# EAGLE design STl-Link-V01 (EAGLE 6.3)
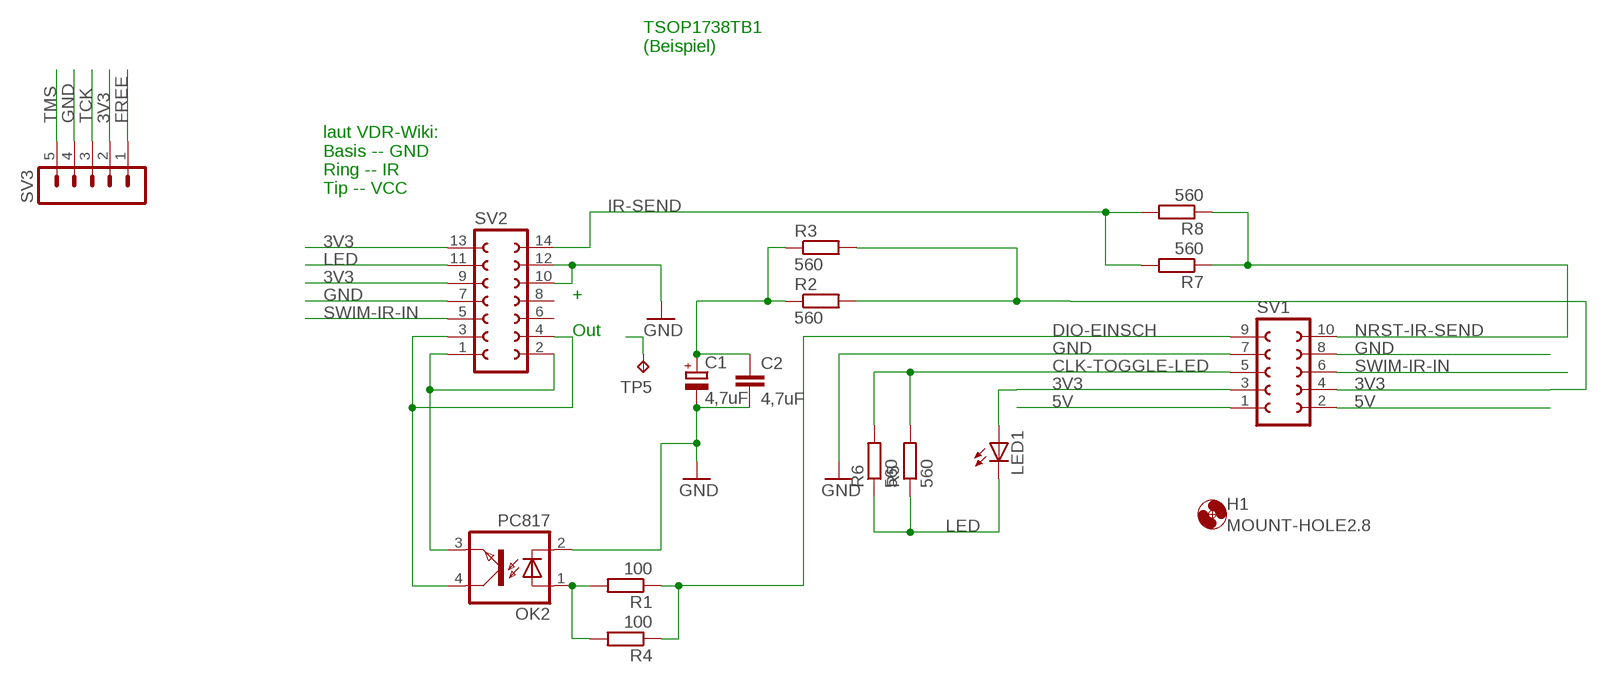
[diagram p0: schematic, sheet 1]

## Parts
C1  4,7uF  CPOL-EUE1.8-4  [E1,8-4]
C2  4,7uF  C-EUC1206K  [C1206K]
H1  MOUNT-HOLE2.8  [2,8]
LED1  LEDCHIPLED_1206  [CHIPLED_1206]
OK2  PC817  [DIL04]
R1  100  R-EU_0204/7  [0204/7]
R2  560  R-EU_0204/7  [0204/7]
R3  560  R-EU_R0805W  [R0805W]
R4  100  R-EU_R0805W  [R0805W]
R5  560  R-EU_0204/7  [0204/7]
R6  560  R-EU_R0805W  [R0805W]
R7  560  R-EU_0204/7  [0204/7]
R8  560  R-EU_R0805W  [R0805W]
SV1  FE05-2  [FE05-2]
SV2  FE07-2W  [FE07-2W]
SV3  MAR05-1  [MAR05-1]
TP5  TPB1,27  [B1,27]

## Nets
3V3: LED1.A R2.2 R3.2 SV1.3 SV1.4 SV2.9 SV2.13 SV3.2
5V: SV1.1 SV1.2
CLK-TOGGLE-LED: R5.2 R6.2 SV1.5
DIO-EINSCH: R1.1 R4.1 SV1.9
FREE: SV3.1
GND: C1.- C2.2 OK2.2(C) SV1.7 SV1.8 SV2.7 SV2.10 SV2.12 SV3.4
IR-SEND: R7.2 R8.2 SV2.14
LED: LED1.C R5.1 R6.1 SV2.11
N$1: C1.+ C2.1 R2.1 R3.1
N$2: OK2.1(A) R1.2 R4.2
N$4: OK2.3(EMIT) SV2.1 SV2.2
NRST-IR-SEND: R7.1 R8.1 SV1.10
OK2: OK2.4(COL) SV2.3 SV2.4
SWIM-IR-IN: SV1.6 SV2.5 TP5.TP
TCK: SV3.3
TMS: SV3.5
Unconnected: SV2.6 SV2.8

## Notes on the sheet
- TSOP1738TB1
  (Beispiel)
- laut VDR-Wiki:
  Basis -- GND
  Ring -- IR
  Tip -- VCC
- +
- Out

## Library data of the parts
C1 = rcl:CPOL-EU: POLARIZED CAPACITOR, European symbol
C2 = rcl:C-EU: CAPACITOR, European symbol
H1 = holes:MOUNT-HOLE: MOUNTING HOLE with drill center marker
LED1 = led:LED: LED OSRAM: - CHIPLED LG R971, LG N971, LY N971, LG Q971, LY Q971, LO R971, LY R971 LH N974, LH R974 LS Q976, LO Q976, LY Q976 LO Q996 - Hyper CHIPLED LW Q18S LB Q993, LB Q99A, LB R99A - SideLED LS A670, LO A670, LY A670, LG A670, LP A670 LB A673, LV A673, LT A673, LW A673 LH A674 LY A675 LS A676, LA A676, LO A676, LY A676, LW A676 LS A679, LY A679, LG A679 - Hyper Micro SIDELED® LS Y876, LA Y876, LO Y876, LY Y876 LT Y87S - SmartLED LW L88C, LW L88S LB L89C, LB L89S, LG L890 LS L89K, LO L89K, LY L89K LS L896, LA L896, LO L896, LY L896 - TOPLED LS T670, LO T670, LY T670, LG T670, LP T670 LSG T670, LSP T670, LSY T670, LOP T670, LYG T670 LG T671, LOG T671, LSG T671 LB T673, LV T673, LT T673, LW T673 LH T674 LS T676, LA T676, LO T676, LY T676, LB T676, LH T676, LSB T676, LW T676 LB T67C, LV T67C, LT T67C, LS T67K, LO T67K, LY T67K, LW E67C LS E67B, LA E67B, LO E67B, LY E67B, LB E67C, LV E67C, LT E67C LW T67C LS T679, LY T679, LG T679 LS T770, LO T770, LY T770, LG T770, LP T770 LB T773, LV T773, LT T773, LW T773 LH T774 LS E675, LA E675, LY E675, LS T675 LS T776, LA T776, LO T776, LY T776, LB T776 LHGB T686 LT T68C, LB T68C - Hyper Mini TOPLED® LB M676 - Mini TOPLED Santana® LG M470 LS M47K, LO M47K, LY M47K Source: http://www.osram.convergy.de LUXEON: - LUMILED® LXK2-PW12-R00, LXK2-PW12-S00, LXK2-PW14-U00, LXK2-PW14-V00 LXK2-PM12-R00, LXK2-PM12-S00, LXK2-PM14-U00 LXK2-PE12-Q00, LXK2-PE12-R00, LXK2-PE12-S00, LXK2-PE14-T00, LXK2-PE14-U00 LXK2-PB12-K00, LXK2-PB12-L00, LXK2-PB12-M00, LXK2-PB14-N00, LXK2-PB14-P00, LXK2-PB14-Q00 LXK2-PR12-L00, LXK2-PR12-M00, LXK2-PR14-Q00, LXK2-PR14-R00 LXK2-PD12-Q00, LXK2-PD12-R00, LXK2-PD12-S00 LXK2-PH12-R00, LXK2-PH12-S00 LXK2-PL12-P00, LXK2-PL12-Q00, LXK2-PL12-R00 Source: www.luxeon.com KINGBRIGHT: KA-3528ASYC Source: www.kingbright.com
OK2 = optocoupler:PC817: SHARP OPTO COUPLER; MPN: PC817X4J000F; OC_FARNELL: 9707727; OC_NEWARK: 97K7059
R1-R8 = rcl:R-EU_: RESISTOR, European symbol
SV1 = con-lsta:FE05-2: FEMALE HEADER; OC_FARNELL: unknown; OC_NEWARK: unknown
SV2 = con-lsta:FE07-2W: FEMALE HEADER; OC_FARNELL: unknown; OC_NEWARK: unknown
SV3 = con-lstb:MAR05-1: PIN HEADER; OC_FARNELL: unknown; OC_NEWARK: unknown
TP5 = testpad:TP: Test pad

## Net classes
0 default: width 0.406 mm

## Board
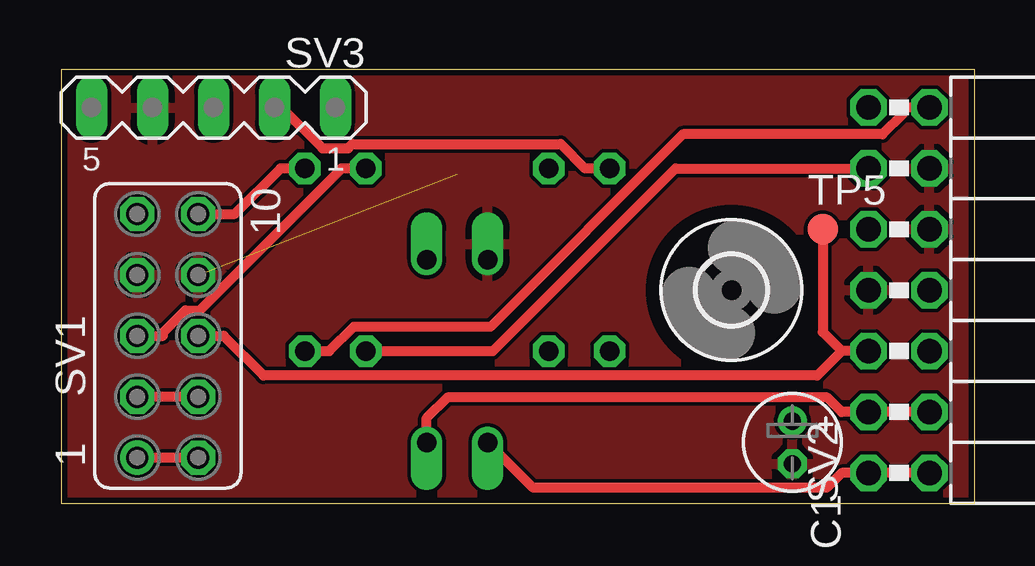
[diagram p1: board, top side]
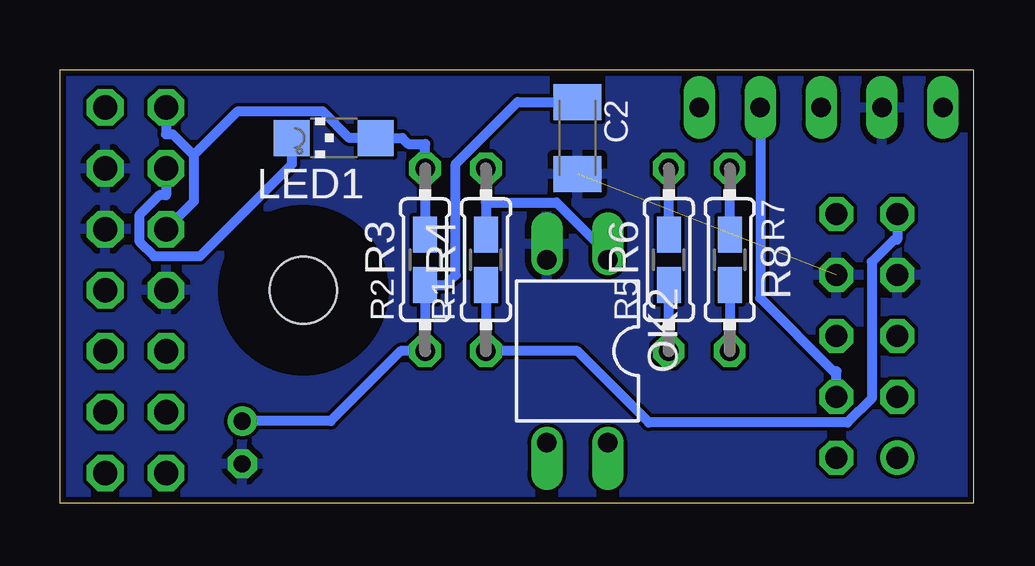
[diagram p2: board, bottom side, seen from below]

Size 38.08 x 18.09 mm. Coordinates in mm from the lower left corner, seen from the top.
Outline: 0,0 38.08,0 38.08,18.09 0,18.09 0,0
Copper layers (1*16): Top 0.035mm / dielectric 1.5mm / Bottom 0.035mm
Design rules "Fusion_eagle_rule_v1.1": minimum track width 6mil, minimum drill 12mil, track to track 6mil, track to pad 6mil, pad to pad 6mil, via to via 6mil, smd to smd 0mil, copper to edge 10mil, drill to drill 10mil, minimum pad ring 10mil, minimum via ring 6mil, stop-mask expansion 2mil, vias tented up to drill 100mil, thermal gap 10mil

### Footprints (pad centres in the part's own frame; a part is rotated, then mirrored left to right if it is on the bottom)
E1,8-4 = drill 0.711 pad 1.168: + -0.889,0 | drill 0.711 pad 1.168 octagon: - 0.889,0
C1206K = smd 1.5 x 2: 1 -1.5,0; 2 1.5,0
2,8 = hole 2.8: 0,0
CHIPLED_1206 = smd 1.5 x 1.5: A 0,-1.75; C 0,1.75
DIL04 = drill 0.813 offset: 1 -1.27,-3.81; 2 1.27,-3.81; 3 1.27,3.81; 4 -1.27,3.81
0204/7 = drill 0.813 octagon: 1 -3.81,0; 2 3.81,0
R0805W = smd 1.5 x 1: 1 -1.052,0; 2 1.052,0
FE05-2 = drill 0.914: 1 -5.08,1.27 | drill 0.914 octagon: 2 -5.08,-1.27; 3 -2.54,1.27; 4 -2.54,-1.27; 5 0,1.27; 6 0,-1.27; 7 2.54,1.27; 8 2.54,-1.27; 9 5.08,1.27; 10 5.08,-1.27
FE07-2W = drill 1.016 octagon: 1 -7.62,1.27; 2 -7.62,-1.27; 3 -5.08,1.27; 4 -5.08,-1.27; 5 -2.54,1.27; 6 -2.54,-1.27; 7 0,1.27; 8 0,-1.27; 9 2.54,1.27; 10 2.54,-1.27; 11 5.08,1.27; 12 5.08,-1.27; 13 7.62,1.27; 14 7.62,-1.27
MAR05-1 = drill 0.813 long: 1 -5.08,0; 2 -2.54,0; 3 0,0; 4 2.54,0; 5 5.08,0
B1,27 = smd 1.27 x 1.27: TP 0,0

### Placement (x,y rotation side)
C1  30.48,2.54 270 top
C2  16.51,15.24 270 bottom
H1  27.94,8.89 0 top
LED1  26.67,15.24 90 bottom
OK2  16.51,6.35 180 bottom
R1  20.32,10.16 90 bottom
R2  22.86,10.16 90 bottom
R3  22.86,10.16 90 bottom
R4  20.32,10.16 90 bottom
R5  12.7,10.16 90 bottom
R6  12.7,10.16 90 bottom
R7  10.16,10.16 270 bottom
R8  10.16,10.16 270 bottom
SV1  4.45,6.99 90 top
SV2  34.92,8.89 90 top
SV3  6.35,16.51 180 top
TP5  31.75,11.43 0 top

### Tracks (layer width: path | path; a pad name or v marks a point on that pad's centre or on a via)
3V3
  Top 0.406: R2.2 21.84,13.97 20.83,14.99 12.14,14.99 11.97,14.81 10.89,14.81 9.2,16.51 SV3.2 | SV1.4 SV1.3
  Bottom 0.406: SV1.4 5.71,5.51 5.85,5.51 8.89,8.55 SV3.2 | R3.2 R2.2 22.86,14.99 23.56,14.99 23.81,15.24 LED1.A 25.12,15.24 26.03,15.24 27.13,16.35 30.67,16.35 32.5,14.52 | 32.5,14.52 32.5,12.59 SV2.9 | 32.5,14.52 33.38,15.39 33.66,15.39 SV2.13
5V
  Top 0.406: SV1.2 SV1.1
CLK-TOGGLE-LED
  Top 0.406: R5.2 11.68,13.97 5.77,8.05 5.17,8.05 4.24,7.12 4.24,6.99 SV1.5
  Bottom 0.406: R6.2 R5.2
DIO-EINSCH
  Bottom 0.406: SV1.9 3.17,11 3.31,11 4.24,10.06 4.24,4.38 5.25,3.37 13.53,3.37 16.51,6.35 R1.1 R4.1
GND  (1 unrouted)
  pour Top: 0,17.78 0,0 36.83,0 38.1,0 38.1,17.78
  pour Bottom: 0,0 38.1,0 38.1,17.78 0,17.78
IR-SEND
  Top 0.406: R7.2 11.18,6.35 12.19,7.37 17.89,7.37 25.91,15.39 34.24,15.39 35.08,16.23 35.08,16.51 SV2.14
  Bottom 0.406: R8.2 R7.2
LED
  Top 0.406: R5.1 17.99,6.35 25.61,13.97 SV2.11
  Bottom 0.406: LED1.C 28.42,14.13 32.24,10.31 34.16,10.31 34.77,10.92 34.77,12.01 33.93,12.85 33.66,12.85 SV2.11 | R5.1 R6.1
N$1
  Bottom 0.406: C2.1 19,16.74 21.59,14.15 21.59,9.52 22,9.11 R3.1 R2.1 23.88,6.35 26.8,3.43 C1.+
N$2
  Bottom 0.406: 20.32,12.54 R4.2 | R1.2 20.32,12.54 | 20.32,12.54 17.39,12.54 15.24,10.4 OK2.1
N$4
  Top 0.406: OK2.3 19.67,0.65 31.92,0.65 32.54,1.27 SV2.1 SV2.2
NRST-IR-SEND
  Top 0.406: R7.1 9.14,13.97 7.24,12.06 SV1.10
  Bottom 0.406: R8.1 R7.1
OK2
  Top 0.406: OK2.4 15.24,3.56 16.1,4.42 31.93,4.42 32.54,3.81 SV2.3 SV2.4
SWIM-IR-IN
  Top 0.406: TP5.TP 31.75,7.14 32.54,6.35 | SV2.5 32.54,6.35 | 32.54,6.35 31.52,5.33 8.43,5.33 6.78,6.99 SV1.6